# Altium schematic sheet MCU.SchDoc
size A3
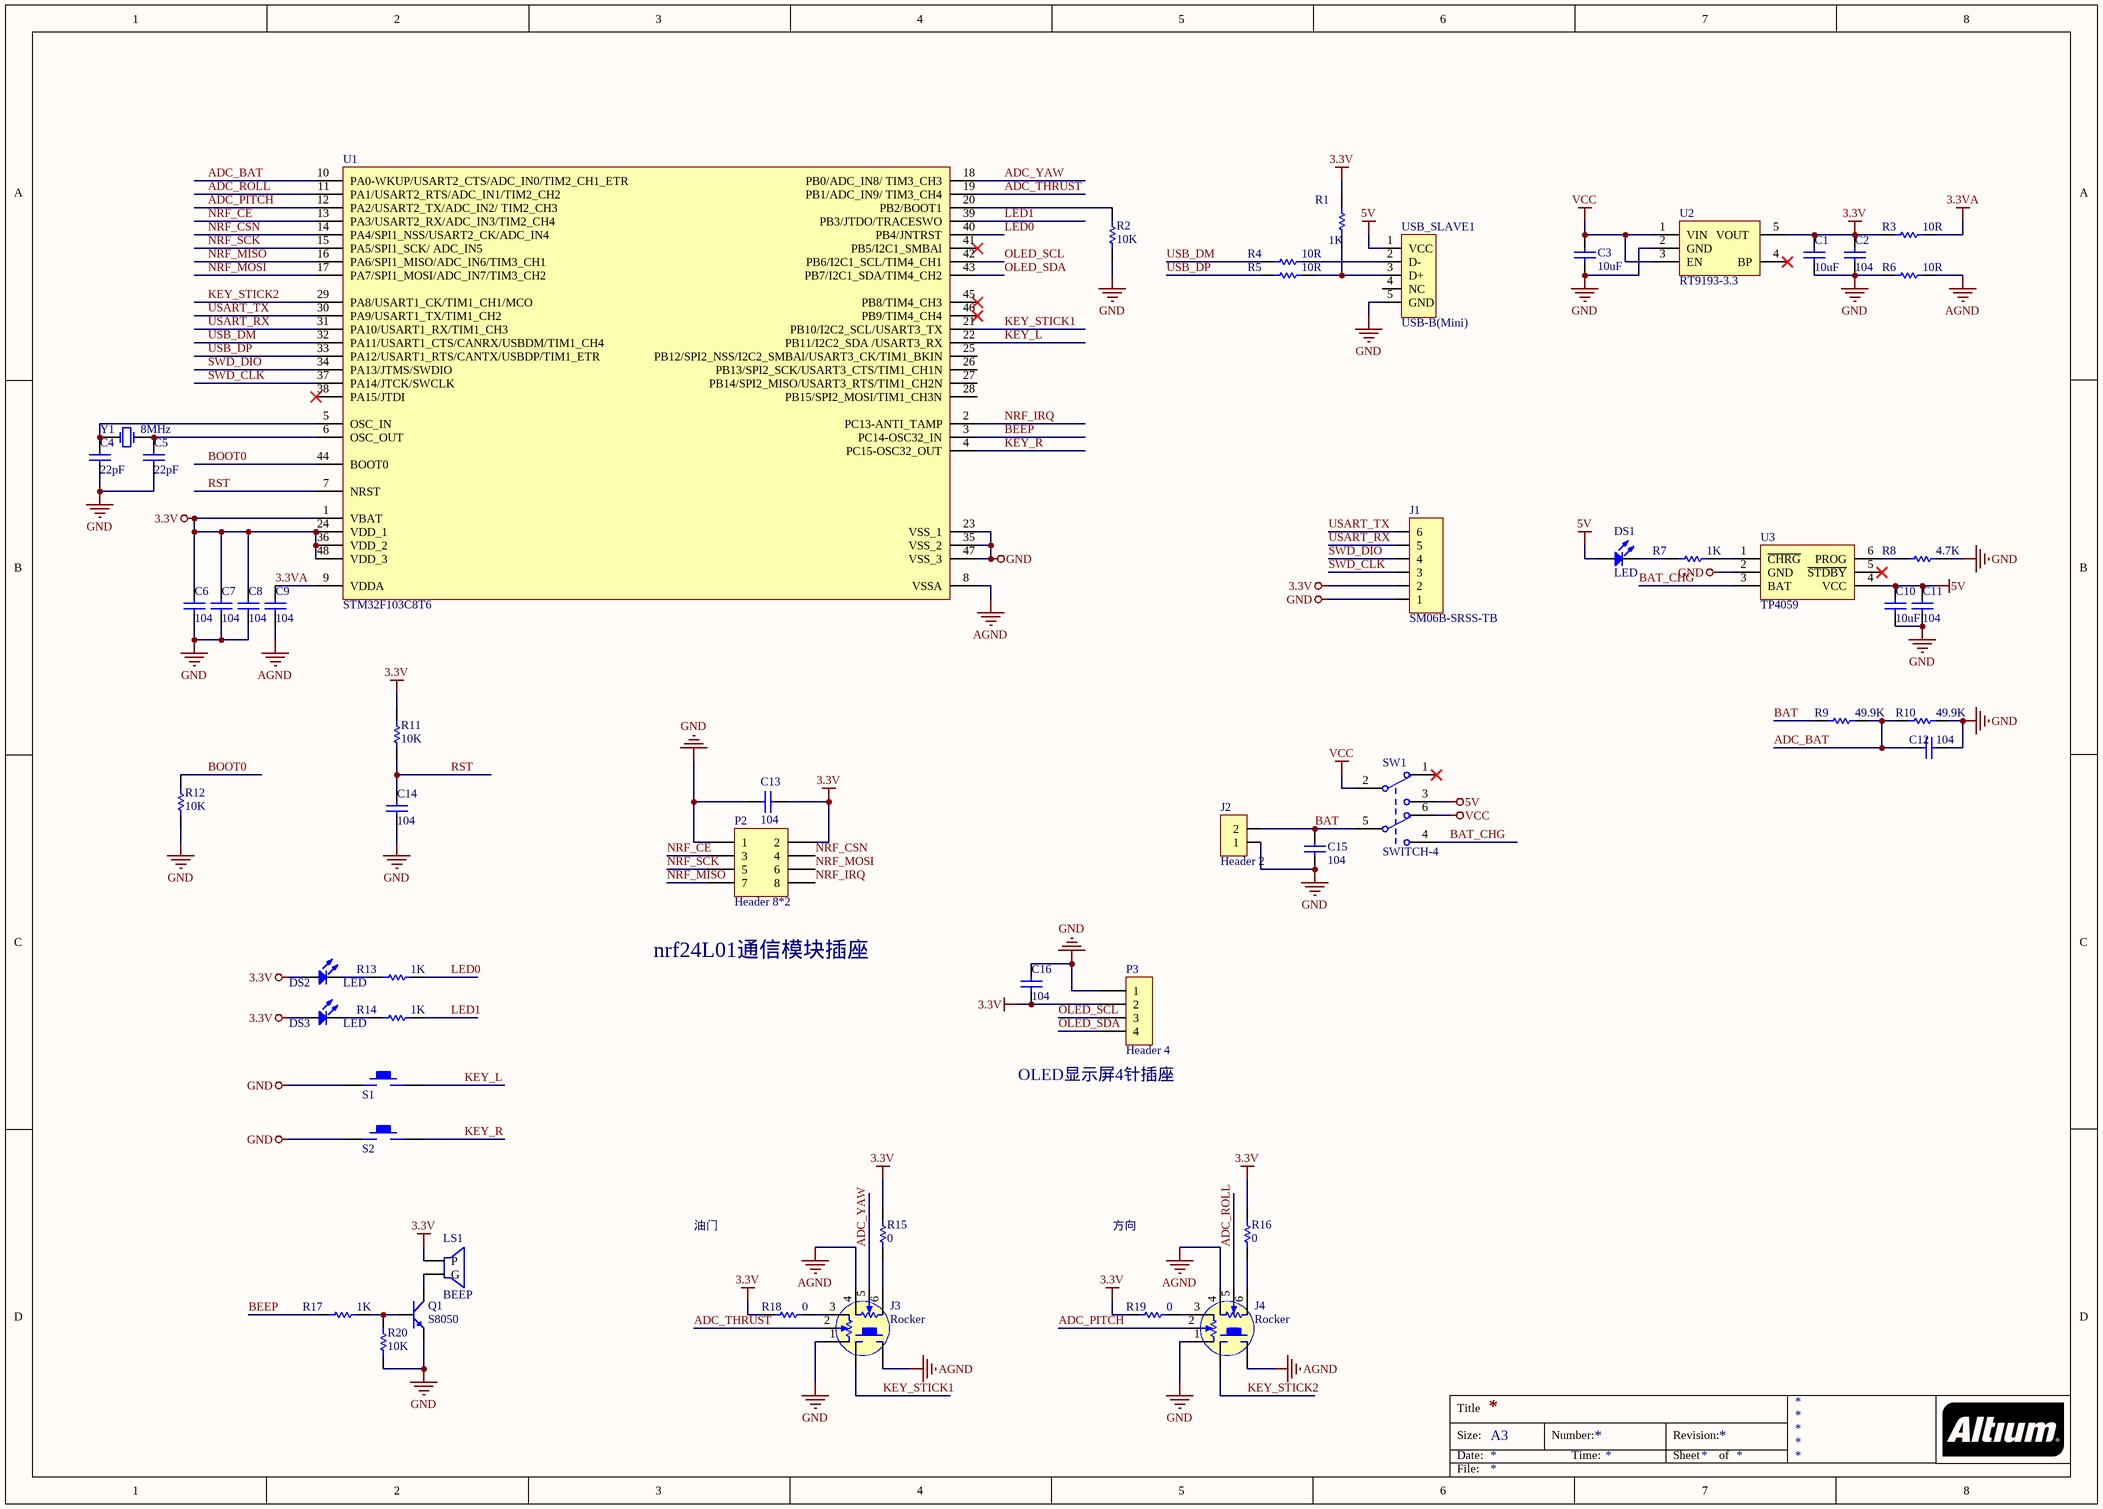
[diagram p0: MCU.SchDoc]

## Parts
C1  10uF  [C0603]
C2  104  [C0603]
C3  10uF  [C0603]
C4  22pF  [C0603]
C5  22pF  [C0603]
C6  104  [C0603]
C7  104  [C0603]
C8  104  [C0603]
C9  104  [C0603]
C10  10uF  [C0603]
C11  104  [C0603]
C12  104  [C0603]
C13  104  [C0603]
C14  104  [C0603]
C15  104  [C0603]
C16  104  [C0603]
DS1  LED  [LED0603]
DS2  LED  [LED0603]
DS3  LED  [LED0603]
J1  SM06B-SRSS-TB  [HDR1X6]
J2  Header 2  [HDR1X2-2MM]
J3  Rocker  [Rocker-RKJXV1224005]
J4  Rocker  [Rocker-RKJXV1224005]
LS1  BEEP  [BEEP-9]
P2  Header 8*2  [HDR4*2]
P3  Header 4  [HDR1X4]
Q1  S8050  [SOT-23R]
R1  1K  [R0603]
R2  10K  [R0603]
R3  10R  [R0603]
R4  10R  [R0603]
R5  10R  [R0603]
R6  10R  [R0603]
R7  1K  [R0603]
R8  4.7K  [R0603]
R9  49.9K  [R0603]
R10  49.9K  [R0603]
R11  10K  [R0603]
R12  10K  [R0603]
R13  1K  [R0603]
R14  1K  [R0603]
R15  0  [R0603]
R16  0  [R0603]
R17  1K  [R0603]
R18  0  [R0603]
R19  0  [R0603]
R20  10K  [R0603]
S1  KEY  [KEY-3X6X3.5-C]  (value not drawn)
S2  KEY  [KEY-3X6X3.5-C]  (value not drawn)
SW1  SWITCH-4  [SW-MSS22D18G2]
U1  STM32F103C8T6  [LQFP-48]
U2  RT9193-3.3  [SOT-23-5]
U3  TP4059  [SOT23-6]
USB_SLAVE1  USB-B(Mini)  [USB-MicroUSB]
Y1  8MHz  [X-NX5032GA]

## Nets
3.3V: C1.2 C2.2 C6.2 C7.2 C8.2 C13.2 C16.2 DS2.1(A) DS3.1(A) J1.2 LS1.1(P) P2.2 P3.2 R1.2 R3.1 R11.2 R15.2 R16.2 R18.2 R19.2 U1.1(VBAT) U1.24(VDD_1) U1.36(VDD_2) U1.48(VDD_3) U2.5(VOUT)
3.3VA: C9.2 R3.2 U1.9(VDDA)
5V: C10.2 C11.2 DS1.1(A) SW1.3 U3.4(VCC) USB_SLAVE1.1(VCC)
AGND: C9.1 J3.4 J3.J1 J4.4 J4.J1 R6.2 U1.8(VSSA)
GND: C1.1 C2.1 C3.1 C4.1 C5.1 C6.1 C7.1 C8.1 C10.1 C11.1 C12.1 C13.1 C14.1 C15.2 C16.1 J1.1 J2.1 J3.1 J4.1 P2.1 P3.1 Q1.1(E) R2.1 R6.1 R8.2 R10.2 R12.1 R20.1 S1.1 S2.1 U1.23(VSS_1) U1.35(VSS_2) U1.47(VSS_3) U2.2(GND) U3.2(GND) USB_SLAVE1.5(GND)
VCC: C3.2 SW1.2 SW1.6 U2.1(VIN) U2.3(EN)
ADC_BAT: C12.2 R9.2 R10.1 U1.10(PA0-WKUP/USART2_CTS/ADC_IN0/TIM2_CH1_ETR)
ADC_PITCH: J4.2 U1.12(PA2/USART2_TX/ADC_IN2/_TIM2_CH3)
ADC_ROLL: J4.5 U1.11(PA1/USART2_RTS/ADC_IN1/TIM2_CH2)
ADC_THRUST: J3.2 U1.19(PB1/ADC_IN9/_TIM3_CH4)
ADC_YAW: J3.5 U1.18(PB0/ADC_IN8/_TIM3_CH3)
BAT: C15.1 J2.2 R9.1 SW1.5
BAT_CHG: SW1.4 U3.3(BAT)
BEEP: R17.1 U1.3(PC14-OSC32_IN)
BOOT0: R12.2 U1.44(BOOT0)
KEY_L: S1.2 U1.22(PB11/I2C2_SDA_/USART3_RX)
KEY_R: S2.2 U1.4(PC15-OSC32_OUT)
KEY_STICK1: J3.J2 U1.21(PB10/I2C2_SCL/USART3_TX)
KEY_STICK2: J4.J2 U1.29(PA8/USART1_CK/TIM1_CH1/MCO)
LED0: R13.2 U1.40(PB4/JNTRST)
LED1: R14.2 U1.39(PB3/JTDO/TRACESWO)
NRF_CE: P2.3 U1.13(PA3/USART2_RX/ADC_IN3/TIM2_CH4)
NRF_CSN: P2.4 U1.14(PA4/SPI1_NSS/USART2_CK/ADC_IN4)
NRF_IRQ: P2.8 U1.2(PC13-ANTI_TAMP)
NRF_MISO: P2.7 U1.16(PA6/SPI1_MISO/ADC_IN6/TIM3_CH1)
NRF_MOSI: P2.6 U1.17(PA7/SPI1_MOSI/ADC_IN7/TIM3_CH2)
NRF_SCK: P2.5 U1.15(PA5/SPI1_SCK/_ADC_IN5)
OLED_SCL: P3.3 U1.42(PB6/I2C1_SCL/TIM4_CH1)
OLED_SDA: P3.4 U1.43(PB7/I2C1_SDA/TIM4_CH2)
RST: C14.2 R11.1 U1.7(NRST)
SWD_CLK: J1.3 U1.37(PA14/JTCK/SWCLK)
SWD_DIO: J1.4 U1.34(PA13/JTMS/SWDIO)
USART_RX: J1.5 U1.31(PA10/USART1_RX/TIM1_CH3)
USART_TX: J1.6 U1.30(PA9/USART1_TX/TIM1_CH2)
USB_DM: R4.1 U1.32(PA11/USART1_CTS/CANRX/USBDM/TIM1_CH4)
USB_DP: R5.1 U1.33(PA12/USART1_RTS/CANTX/USBDP/TIM1_ETR)
NetC4_2: C4.2 U1.5(OSC_IN) Y1.1(OSC1)
NetC5_2: C5.2 U1.6(OSC_OUT) Y1.2(OSC2)
NetDS1_2: DS1.2(K) R7.1
NetDS2_2: DS2.2(K) R13.1
NetDS3_2: DS3.2(K) R14.1
NetJ3_3: J3.3 R18.1
NetJ3_6: J3.6 R15.1
NetJ4_3: J4.3 R19.1
NetJ4_6: J4.6 R16.1
NetLS1_2: LS1.2(G) Q1.3(C)
NetQ1_2: Q1.2(B) R17.2 R20.2
NetR1_1: R1.1 R5.2 USB_SLAVE1.3(D+)
NetR2_2: R2.2 U1.20(PB2/BOOT1)
NetR4_2: R4.2 USB_SLAVE1.2(D-)
NetR7_2: R7.2 U3.1(~{CHRG})
NetR8_1: R8.1 U3.6(PROG)

Not connected (* = marked no-connect by the designer): SW1 1*; U1 25(PB12/SPI2_NSS/I2C2_SMBAl/USART3_CK/TIM1_BKIN) 26(PB13/SPI2_SCK/USART3_CTS/TIM1_CH1N) 27(PB14/SPI2_MISO/USART3_RTS/TIM1_CH2N) 28(PB15/SPI2_MOSI/TIM1_CH3N) 38(PA15/JTDI)* 41(PB5/I2C1_SMBAl)* 45(PB8/TIM4_CH3)* 46(PB9/TIM4_CH4)*; U2 4(BP)*; U3 5(~{STDBY})*; USB_SLAVE1 4(NC)

## Notes on the sheet
- nrf24L01通信模块插座
- (near P3) OLED显示屏4针插座
- 油门
- 方向
- Title
- Size:
- Date:
- A3
- Number:
- Time:
- Revision:
- Sheet
- of
- File:

## Library data of the parts
C1-C16 = C0603: 电容; Published: 8-Jun-2000; LatestRevisionDate: 17-Jul-2002; LatestRevisionNote: Re-released for DXP Platform.; PackageReference: RAD-0.3; Publisher: Altium Limited; PackageDescription: Radial Cap, Thru-Hole; 2 Leads; 0.3 in Pin Spacing; UnitPrice: 0.02
DS1-DS3 = LED: Typical RED, GREEN, YELLOW, AMBER GaAs LED; Published: 8-Jun-2000; LatestRevisionDate: 17-Jul-2002; LatestRevisionNote: Re-released for DXP Platform.; PackageDocument: Feb-2002; PackageReference: 3.2X1.6X1.1; Publisher: Altium Limited; UnitPrice: 0.05
J2 = Header 2: Header, 2-Pin; LatestRevisionDate: 17-Jul-2002; LatestRevisionNote: Re-released for DXP Platform.; Publisher: Altium Limited
J3 J4 = Rocker: 航模摇杆
LS1 = BEEP: 蜂鸣器; UnitPrice: 0.5
P2 = Header 4*2: Header, 8-Pin; LatestRevisionDate: 17-Jul-2002; LatestRevisionNote: Re-released for DXP Platform.; Publisher: Altium Limited
P3 = Header 4: Header, 8-Pin; LatestRevisionDate: 17-Jul-2002; LatestRevisionNote: Re-released for DXP Platform.; Publisher: Altium Limited
Q1 = NPN: 8050/BCW846/BCW847
R1-R20 = RES0603: 电阻; Published: 8-Jun-2000; LatestRevisionDate: 17-Jul-2002; LatestRevisionNote: Re-released for DXP Platform.; PackageReference: AXIAL-0.3; Publisher: Altium Limited; PackageDescription: Axial Device, Thru-Hole; 2 Leads; 0.3 in Pin Spacing
S1 S2 = KEY: 普通轻触按钮
U3 = TP4059: 锂电池充电IC
USB_SLAVE1 = USB5
Y1 = XTAL: Crystal Oscillator; Published: 8-Jun-2000; LatestRevisionDate: 17-Jul-2002; LatestRevisionNote: Re-released for DXP Platform.; Publisher: Altium Limited